# Altium project MS5837 V1.0.PrjPCB
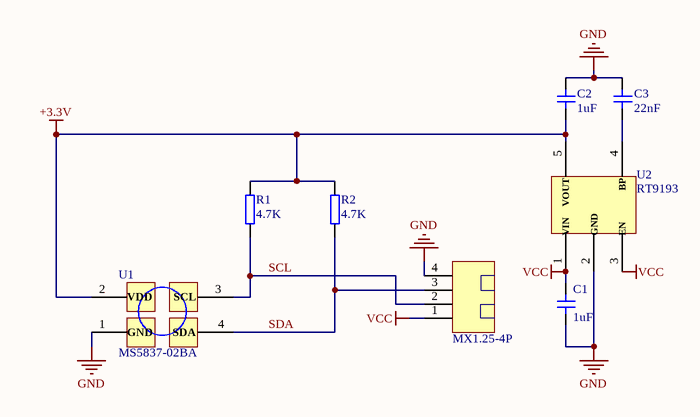
[diagram p0: MS5837 V1.0.SchDoc]
1 sheet, 8 parts. Net scope: global (net labels, ports and power ports of the same name join across sheets).
Board file: MS5837 V1.0.PcbDoc

## Sheet MS5837 V1.0.SchDoc
size A4

### Parts
C1  1uF  [0603C]
C2  1uF  [0603C]
C3  22nF  [0603C]
J?  MX1.25-4P  [MX1.25S-4P]
R1  4.7K  [0603R]
R2  4.7K  [0603R]
U1  MS5837-02BA  [MS5837-02BA]
U2  RT9193  [SOT23-5]

### Nets
+3.3V: C2.1 R1.2 R2.2 U1.2(VDD) U2.5(VOUT)
GND: C1.1 C2.2 C3.2 J?.4 U1.1(GND) U2.2(GND)
VCC: C1.2 J?.1 U2.1(VIN) U2.3(EN)
SCL: J?.2 R1.1 U1.3(SCL)
SDA: J?.3 R2.1 U1.4(SDA)
NetC3_1: C3.1 U2.4(BP)

### Library data of the parts
C1-C3 = Cap1: 无极贴片电容
R1 R2 = Res: 电阻